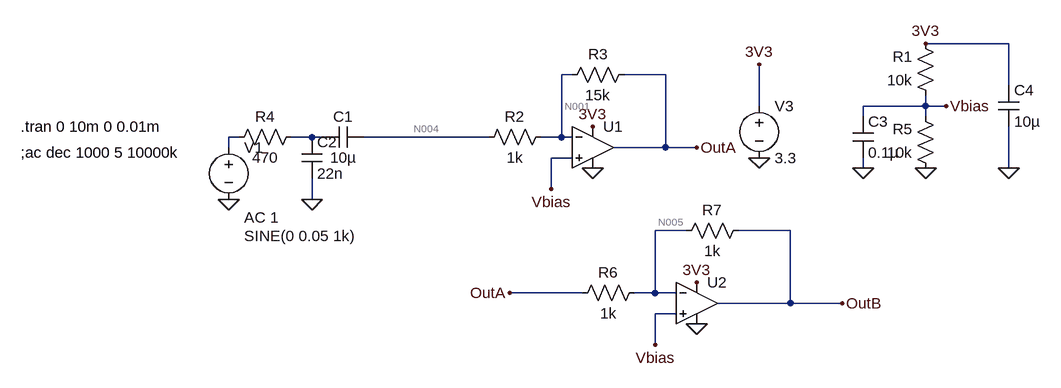
[diagram p0: schematic MicAndAmp.asc]
MicAndAmp.asc, the LTspice schematic file:
Version 4
SHEET 1 1208 680
WIRE 1152 32 1024 32
WIRE 480 80 464 80
WIRE 624 80 560 80
WIRE 1152 96 1152 32
WIRE 768 128 768 64
WIRE 1024 128 1024 112
WIRE 1024 128 928 128
WIRE 1056 128 1024 128
WIRE 928 144 928 128
WIRE 1024 144 1024 128
WIRE -32 176 -48 176
WIRE 80 176 48 176
WIRE 96 176 80 176
WIRE 352 176 160 176
WIRE 464 176 464 80
WIRE 464 176 432 176
WIRE 480 176 464 176
WIRE -48 192 -48 176
WIRE 624 192 624 80
WIRE 624 192 544 192
WIRE 672 192 624 192
WIRE 480 208 448 208
WIRE 928 224 928 208
WIRE 1152 224 1152 160
WIRE 448 256 448 208
WIRE 80 272 80 240
WIRE 656 320 608 320
WIRE 816 320 736 320
WIRE 496 416 384 416
WIRE 608 416 608 320
WIRE 608 416 576 416
WIRE 640 416 608 416
WIRE 816 432 816 320
WIRE 816 432 704 432
WIRE 896 432 816 432
WIRE 640 448 608 448
WIRE 608 496 608 448
FLAG 448 256 Vbias
FLAG 512 224 0
FLAG 512 160 3V3
FLAG -48 272 0
FLAG 768 208 0
FLAG 768 64 3V3
FLAG 80 272 0
FLAG 1056 128 Vbias
FLAG 1024 32 3V3
FLAG 1024 224 0
FLAG 928 224 0
FLAG 1152 224 0
FLAG 672 400 3V3
FLAG 672 464 0
FLAG 608 496 Vbias
FLAG 672 192 OutA
FLAG 384 416 OutA
FLAG 896 432 OutB
SYMBOL cap 96 192 R270
WINDOW 0 32 32 VTop 2
WINDOW 3 0 32 VBottom 2
SYMATTR InstName C1
SYMATTR Value 10µ
SYMBOL res 336 192 R270
WINDOW 0 32 56 VTop 2
WINDOW 3 0 56 VBottom 2
SYMATTR InstName R2
SYMATTR Value 1k
SYMBOL res 464 96 R270
WINDOW 0 32 56 VTop 2
WINDOW 3 0 56 VBottom 2
SYMATTR InstName R3
SYMATTR Value 15k
SYMBOL voltage -48 176 R0
WINDOW 3 24 152 Left 2
WINDOW 123 24 124 Left 2
WINDOW 39 0 0 Left 2
SYMATTR Value SINE(0 0.05 1k)
SYMATTR Value2 AC 1
SYMATTR InstName V1
SYMBOL Opamps\\UniversalOpamp2 512 192 R0
SYMATTR InstName U1
SYMATTR Value2 Avol=1Meg GBW=1Meg Slew=1Meg
SYMATTR SpiceLine ilimit=2m rail=0 Vos=0 phimargin=45
SYMATTR SpiceLine2 en=0 enk=0 in=0 ink=0 Rin=1Meg
SYMBOL voltage 768 112 R0
WINDOW 123 0 0 Left 2
WINDOW 39 0 0 Left 2
SYMATTR InstName V3
SYMATTR Value 3.3
SYMBOL cap 64 176 R0
SYMATTR InstName C2
SYMATTR Value 22n
SYMBOL res 64 160 R90
WINDOW 0 0 56 VBottom 2
WINDOW 3 32 56 VTop 2
SYMATTR InstName R4
SYMATTR Value 470
SYMBOL res 1040 128 R180
WINDOW 0 36 76 Left 2
WINDOW 3 36 40 Left 2
SYMATTR InstName R1
SYMATTR Value 10k
SYMBOL res 1040 240 R180
WINDOW 0 36 76 Left 2
WINDOW 3 36 40 Left 2
SYMATTR InstName R5
SYMATTR Value 10k
SYMBOL cap 912 144 R0
SYMATTR InstName C3
SYMATTR Value 0.1µ
SYMBOL cap 1136 96 R0
SYMATTR InstName C4
SYMATTR Value 10µ
SYMBOL Opamps\\UniversalOpamp2 672 432 R0
SYMATTR InstName U2
SYMATTR Value2 Avol=1Meg GBW=1Meg Slew=1Meg
SYMATTR SpiceLine ilimit=2m rail=0 Vos=0 phimargin=45
SYMATTR SpiceLine2 en=0 enk=0 in=0 ink=0 Rin=1Meg
SYMBOL res 480 432 R270
WINDOW 0 32 56 VTop 2
WINDOW 3 0 56 VBottom 2
SYMATTR InstName R6
SYMATTR Value 1k
SYMBOL res 640 336 R270
WINDOW 0 32 56 VTop 2
WINDOW 3 0 56 VBottom 2
SYMATTR InstName R7
SYMATTR Value 1k
TEXT -368 200 Left 2 !;ac dec 1000 5 10000k
TEXT -368 160 Left 2 !.tran 0 10m 0 0.01m

The netlist it stands for:
* MicAndAmp.asc
C1 N003 N004 10µ
R2 N004 N001 1k
R3 N001 OutA 15k
V1 N002 0 SINE(0 0.05 1k) AC 1
XU1 Vbias N001 3V3 0 OutA level.2 Avol=1Meg GBW=1Meg Slew=1Meg ilimit=2m rail=0 Vos=0 phimargin=45 en=0 enk=0 in=0 ink=0 Rin=1Meg  ; pins IN+ IN- V+ V- OUT
V3 3V3 0 3.3
C2 N003 0 22n
R4 N003 N002 470
R1 Vbias 3V3 10k
R5 0 Vbias 10k
C3 Vbias 0 0.1µ
C4 3V3 0 10µ
XU2 Vbias N005 3V3 0 OutB level.2 Avol=1Meg GBW=1Meg Slew=1Meg ilimit=2m rail=0 Vos=0 phimargin=45 en=0 enk=0 in=0 ink=0 Rin=1Meg  ; pins IN+ IN- V+ V- OUT
R6 OutA N005 1k
R7 N005 OutB 1k
;ac dec 1000 5 10000k
.tran 0 10m 0 0.01m
.lib UniversalOpamps2.sub
.backanno
.end

* Results of the author's LTspice run, read from the files saved beside the schematic
* Operating Point, zero values left out:
*   V(n004) = 1.65 V
*   V(n001) = 1.65 V
*   V(outa) = 1.65 V
*   V(3v3) = 3.3 V
*   V(vbias) = 1.65 V
*   V(outb) = 1.65 V
*   V(n005) = 1.65 V
*   I(R5) = -165 µA
*   I(R1) = -165 µA
*   I(V3) = -497.6 µA
*   Ix(u1:3) = 166.3 µA
*   Ix(u1:4) = -166.3 µA
*   Ix(u2:3) = 166.3 µA
*   Ix(u2:4) = -166.3 µA
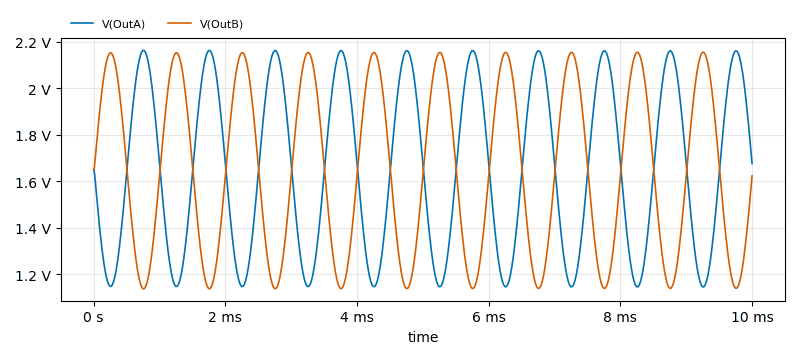
[diagram p1: Transient Analysis of MicAndAmp.asc, plotted from the saved traces]
* Transient Analysis, 1 run:
*   V(OutA): min 1.144 V, max 2.164 V, average 1.654 V, rms 1.693 V, last 1.676 V
*   V(OutB): min 1.136 V, max 2.156 V, average 1.646 V, rms 1.685 V, last 1.623 V